# EAGLE design Audio-3 (EAGLE 7.2.0)
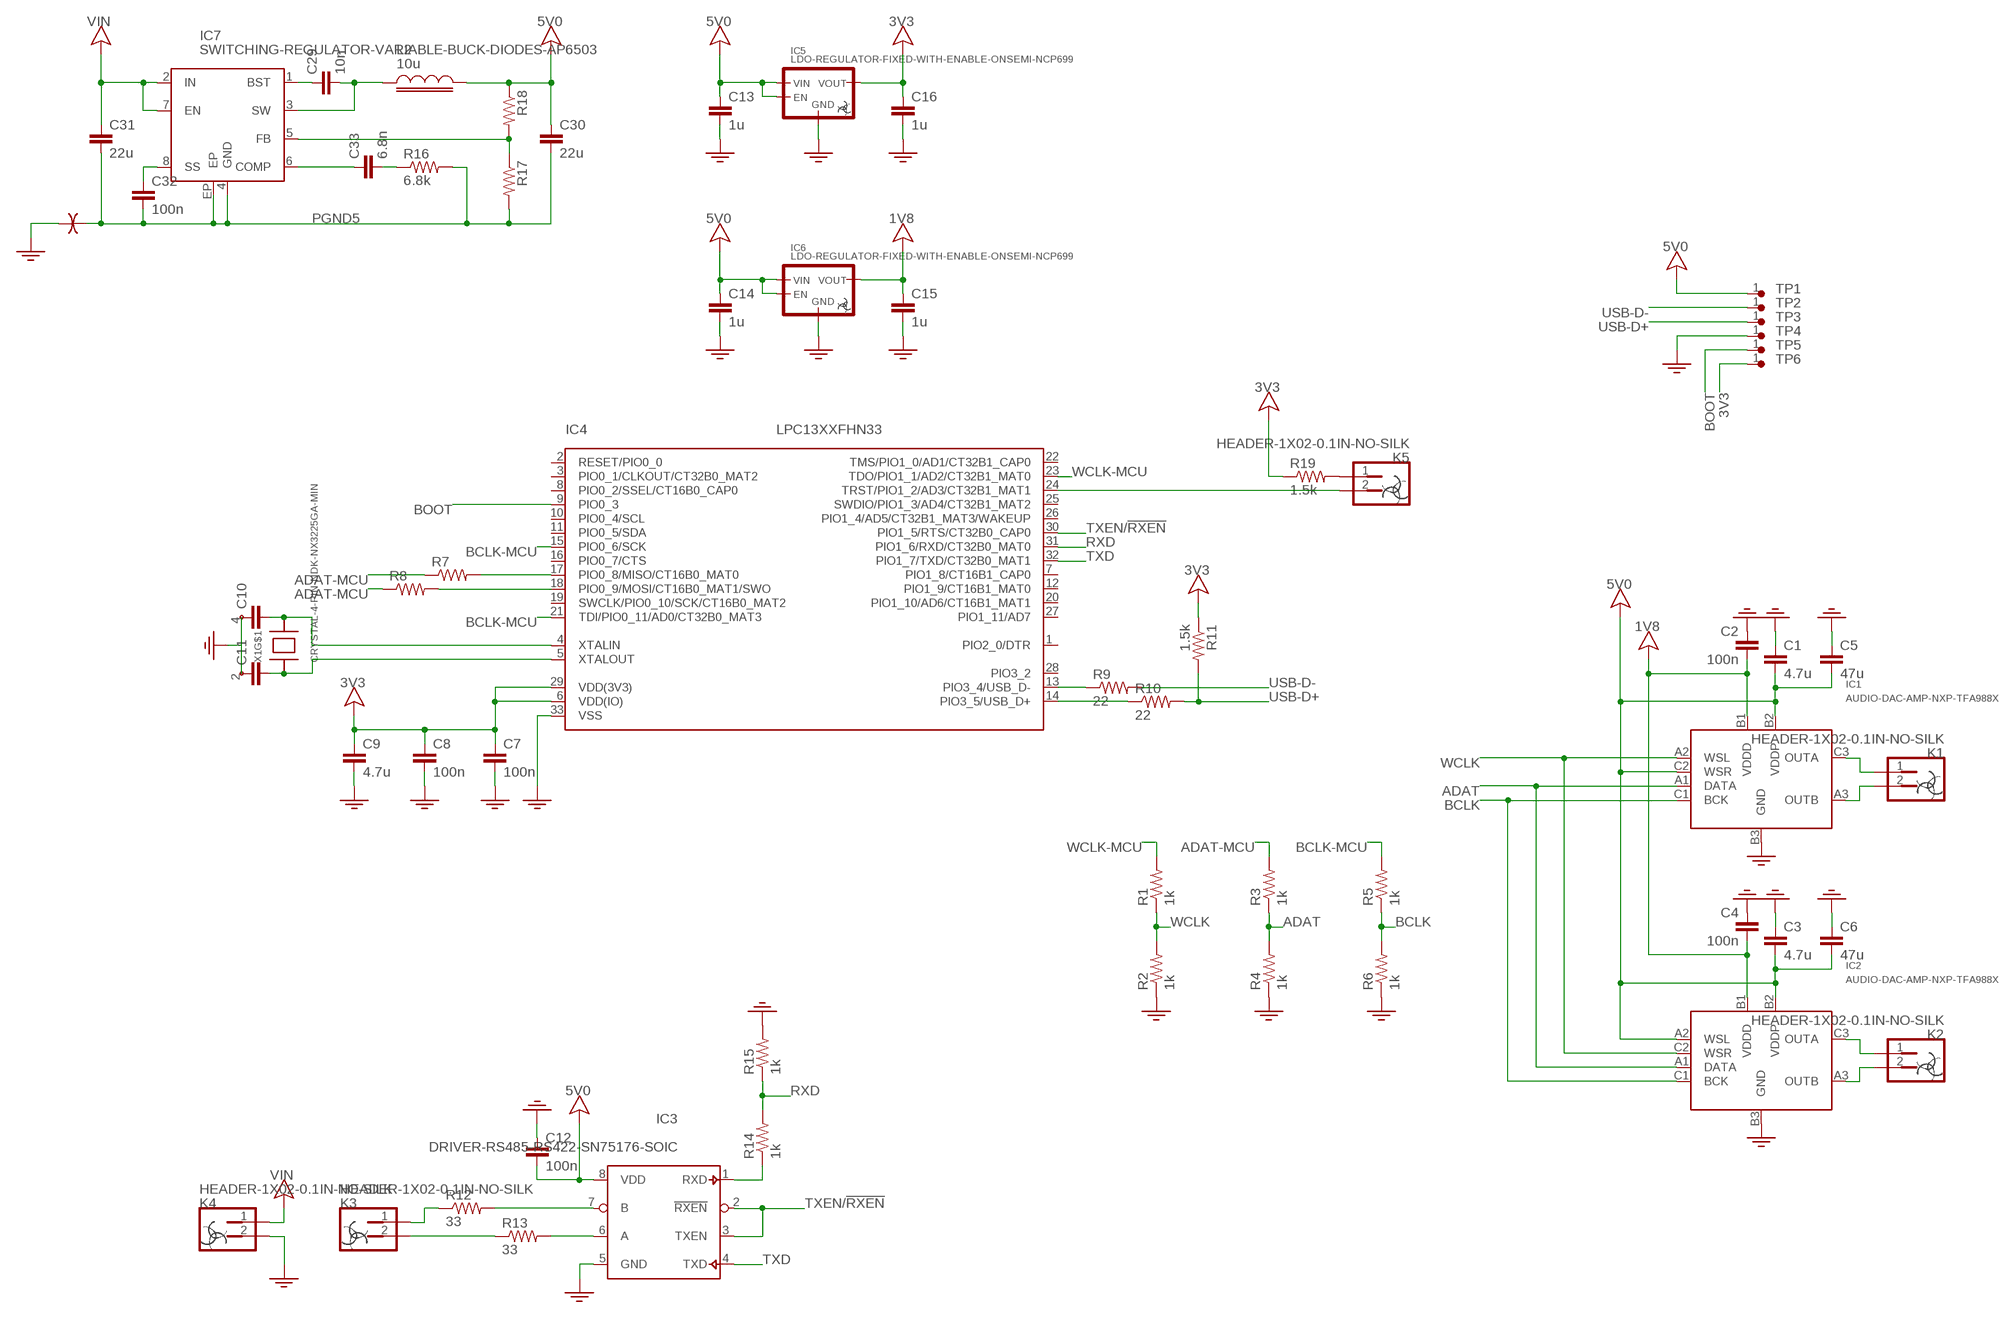
[diagram p0: schematic, sheet 1]

## Parts
C1  4.7u  CAP-0603-MIN  [0603-MIN]
C2  100n  CAP-0603-MIN  [0603-MIN]
C3  4.7u  CAP-0603-MIN  [0603-MIN]
C4  100n  CAP-0603-MIN  [0603-MIN]
C5  47u  CAP-1206-MIN  [1206-MIN]
C6  47u  CAP-1206-MIN  [1206-MIN]
C7  100n  CAP-0603-MIN  [0603-MIN]
C8  100n  CAP-0603-MIN  [0603-MIN]
C9  4.7u  CAP-0603-MIN  [0603-MIN]
C10  CAP-0603-MIN  [0603-MIN]
C11  CAP-0603-MIN  [0603-MIN]
C12  100n  CAP-0603-MIN  [0603-MIN]
C13  1u  CAP-0603-MIN  [0603-MIN]
C14  1u  CAP-0603-MIN  [0603-MIN]
C15  1u  CAP-0603-MIN  [0603-MIN]
C16  1u  CAP-0603-MIN  [0603-MIN]
C29  10n  CAP-0603-MIN  [0603-MIN]
C30  22u  CAP-1206  [1206]
C31  22u  CAP-1206  [1206]
C32  100n  CAP-0603-MIN  [0603-MIN]
C33  6.8n  CAP-0603-MIN  [0603-MIN]
IC1  AUDIO-DAC-AMP-NXP-TFA988X  [NXP-TFA988X-WLCSP9]
IC2  AUDIO-DAC-AMP-NXP-TFA988X  [NXP-TFA988X-WLCSP9]
IC3  DRIVER-RS485-RS422-SN75176-SOIC  [EIAJ-SOIC8]
IC4  LPC13XXFHN33  [HVQFN33-7X7MM]
IC5  LDO-REGULATOR-FIXED-WITH-ENABLE-ONSEMI-NCP699  [SOT23-5]
IC6  LDO-REGULATOR-FIXED-WITH-ENABLE-ONSEMI-NCP699  [SOT23-5]
IC7  SWITCHING-REGULATOR-VARIABLE-BUCK-DIODES-AP6503  [EIAJ-SOIC8-3.9MM-EXPOSED-PAD]
K1  HEADER-1X02-0.1IN-NO-SILK  [HEADER-1X02-NO-SILK]
K2  HEADER-1X02-0.1IN-NO-SILK  [HEADER-1X02-NO-SILK]
K3  HEADER-1X02-0.1IN-NO-SILK  [HEADER-1X02-NO-SILK]
K4  HEADER-1X02-0.1IN-NO-SILK  [HEADER-1X02-NO-SILK]
K5  HEADER-1X02-0.1IN-NO-SILK  [HEADER-1X02-NO-SILK]
L2  10u  INDUCTOR-1210  [1210]
R1  1k  RESISTOR-0603-MIN  [0603-MIN]
R2  1k  RESISTOR-0603-MIN  [0603-MIN]
R3  1k  RESISTOR-0603-MIN  [0603-MIN]
R4  1k  RESISTOR-0603-MIN  [0603-MIN]
R5  1k  RESISTOR-0603-MIN  [0603-MIN]
R6  1k  RESISTOR-0603-MIN  [0603-MIN]
R7  RESISTOR-0603-MIN  [0603-MIN]
R8  RESISTOR-0603-MIN  [0603-MIN]
R9  22  RESISTOR-0603-MIN  [0603-MIN]
R10  22  RESISTOR-0603-MIN  [0603-MIN]
R11  1.5k  RESISTOR-0603-MIN  [0603-MIN]
R12  33  RESISTOR-0805  [0805-MIN]
R13  33  RESISTOR-0805  [0805-MIN]
R14  1k  RESISTOR-0603-MIN  [0603-MIN]
R15  1k  RESISTOR-0603-MIN  [0603-MIN]
R16  6.8k  RESISTOR-0603-MIN  [0603-MIN]
R17  RESISTOR-0603-MIN  [0603-MIN]
R18  RESISTOR-0603-MIN  [0603-MIN]
R19  1.5k  RESISTOR-0603-MIN  [0603-MIN]
TP1  TEST-POINT-0.75MM  [TEST-POINT-0.75MM]
TP2  TEST-POINT-0.75MM  [TEST-POINT-0.75MM]
TP3  TEST-POINT-0.75MM  [TEST-POINT-0.75MM]
TP4  TEST-POINT-0.75MM  [TEST-POINT-0.75MM]
TP5  TEST-POINT-0.75MM  [TEST-POINT-0.75MM]
TP6  TEST-POINT-0.75MM  [TEST-POINT-0.75MM]
U4  GND-ISOLATOR-0.032"  [GND-ISOLATOR-0.032"]
X1  CRYSTAL-4-PIN-NDK-NX3225GA-MIN  [CRYSTAL-NDK-NX3225GA-3X2.5MM-MIN]

## Nets
1V8: C2.1 C4.1 C15.2 IC1.B1(VDDD) IC2.B1(VDDD) IC6.5(VOUT) ; supply symbol labelled V
3V3: C7.2 C8.2 C9.2 C16.2 IC4.6(VDD(IO)) IC4.29(VDD(3V3)) IC5.5(VOUT) R11.1 R19.1 TP6.1 ; supply symbol labelled V
5V0: C1.1 C3.1 C5.1 C6.1 C12.1 C13.2 C14.2 C30.2 IC1.B2(VDDP) IC1.C2(WSR) IC2.A2(WSL) IC2.B2(VDDP) IC3.8(VDD) IC5.1(VIN) IC5.3(EN) IC6.1(VIN) IC6.3(EN) L2.2 R18.1 TP1.1 ; supply symbol labelled V
5V0FB: IC7.5(FB) R17.1 R18.2
ADAT: IC1.A1(DATA) IC2.A1(DATA) R3.1 R4.2
ADAT-MCU: R3.2 R7.1 R8.1
BCLK: IC1.C1(BCK) IC2.C1(BCK) R5.1 R6.2
BCLK-MCU: IC4.15(PIO0_6/SCK) IC4.21(TDI/PIO0_11/AD0/CT32B0_MAT3) R5.2
BOOT: IC4.9(PIO0_3) TP5.1
GND: C1.2 C2.2 C3.2 C4.2 C5.2 C6.2 C7.1 C8.1 C9.1 C10.2 C11.2 C12.2 C13.1 C14.1 C15.1 C16.1 IC1.B3(GND) IC2.B3(GND) IC3.5(GND) IC4.33(VSS) IC5.2(GND) IC6.2(GND) K4.2 R2.1 R4.1 R6.1 R15.2 TP4.1 U4.B X1.2 X1.4
N$1: IC4.17(PIO0_8/MISO/CT16B0_MAT0) R7.2
N$2: IC4.18(PIO0_9/MOSI/CT16B0_MAT1/SWO) R8.2
N$3: C10.1 IC4.4(XTALIN) X1.3
N$4: C11.1 IC4.5(XTALOUT) X1.1
N$5: IC4.13(PIO3_4/USB_D-) R9.1
N$6: IC4.14(PIO3_5/USB_D+) R10.1
N$7: IC3.7(B) R12.2
N$8: IC1.C3(OUTA) K1.1
N$9: IC1.A3(OUTB) K1.2
N$10: IC2.C3(OUTA) K2.1
N$11: IC2.A3(OUTB) K2.2
N$12: IC3.6(A) R13.2
N$13: C29.1 IC7.3(SW) L2.1
N$14: IC3.1(RXD) R14.1
N$15: C29.2 IC7.1(BST)
N$16: C33.2 IC7.6(COMP)
N$17: C33.1 R16.1
N$18: K3.2 R13.1
N$19: K3.1 R12.1
N$20: C32.2 IC7.8(SS)
N$22: K5.1 R19.2
N$23: IC4.24(TRST/PIO1_2/AD3/CT32B1_MAT1) K5.2
PGND5: C30.1 C31.1 C32.1 IC7.4(GND) IC7.EP R16.2 R17.2 U4.A
RXD: IC4.31(PIO1_6/RXD/CT32B0_MAT0) R14.2 R15.1
TXD: IC3.4(TXD) IC4.32(PIO1_7/TXD/CT32B0_MAT1)
TXEN/!RXEN: IC3.2(!RXEN) IC3.3(TXEN) IC4.30(PIO1_5/RTS/CT32B0_CAP0)
USB-D+: R10.2 R11.2 TP3.1
USB-D-: R9.2 TP2.1
VIN: C31.2 IC7.2(IN) IC7.7(EN) K4.1 ; supply symbol labelled V
WCLK: IC1.A2(WSL) IC2.C2(WSR) R1.1 R2.2
WCLK-MCU: IC4.23(TDO/PIO1_1/AD2/CT32B1_MAT0) R1.2
Unconnected: IC4.1(PIO2_0/DTR) IC4.2(RESET/PIO0_0) IC4.3(PIO0_1/CLKOUT/CT32B0_MAT2) IC4.7(PIO1_8/CT16B1_CAP0) IC4.8(PIO0_2/SSEL/CT16B0_CAP0) IC4.10(PIO0_4/SCL) IC4.11(PIO0_5/SDA) IC4.12(PIO1_9/CT16B1_MAT0) IC4.16(PIO0_7/CTS) IC4.19(SWCLK/PIO0_10/SCK/CT16B0_MAT2) IC4.20(PIO1_10/AD6/CT16B1_MAT1) IC4.22(TMS/PIO1_0/AD1/CT32B1_CAP0) IC4.25(SWDIO/PIO1_3/AD4/CT32B1_MAT2) IC4.26(PIO1_4/AD5/CT32B1_MAT3/WAKEUP) IC4.27(PIO1_11/AD7) IC4.28(PIO3_2)

## Library data of the parts
C1-C16 C29-C33 = Outbreak:CAP
IC1 IC2 = Outbreak:AUDIO-DAC-AMP-NXP-TFA988X
IC3 = Outbreak:DRIVER-RS485-RS422-SN75176
IC4 = Outbreak:LPC13XXFHN33: LPC1313 72 MHz 32-bit ARM Cortex-M3 based microcontroller featuring a high level of integration and low power consumption. 32 kB Flash, 8 kB SRAM MarcVl - Datasheet available on www.nxp.com
IC5 IC6 = Outbreak:LDO-REGULATOR-FIXED-WITH-ENABLE: Low Drop-Out (LDO) Volt Regulator with enable pin (active at logic high.)
IC7 = Outbreak:SWITCHING-REGULATOR-VARIABLE-BUCK-DIODES-AP6503
K1-K5 = Outbreak:HEADER-1X02
L2 = Outbreak:INDUCTOR
R1-R19 = Outbreak:RESISTOR: Resistor Basic schematic elements and footprints for 0603, 1206, and PTH resistors.
TP1-TP6 = Outbreak:TEST-POINT
U4 = Outbreak:GND-ISOLATOR
X1 = Outbreak:CRYSTAL-4-PIN

## Board
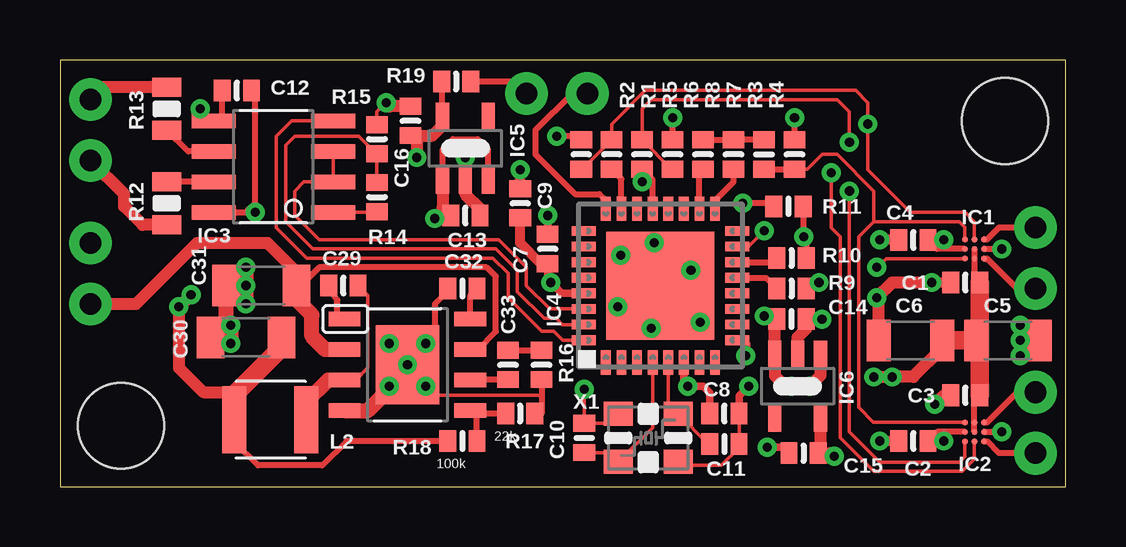
[diagram p1: board, top side]
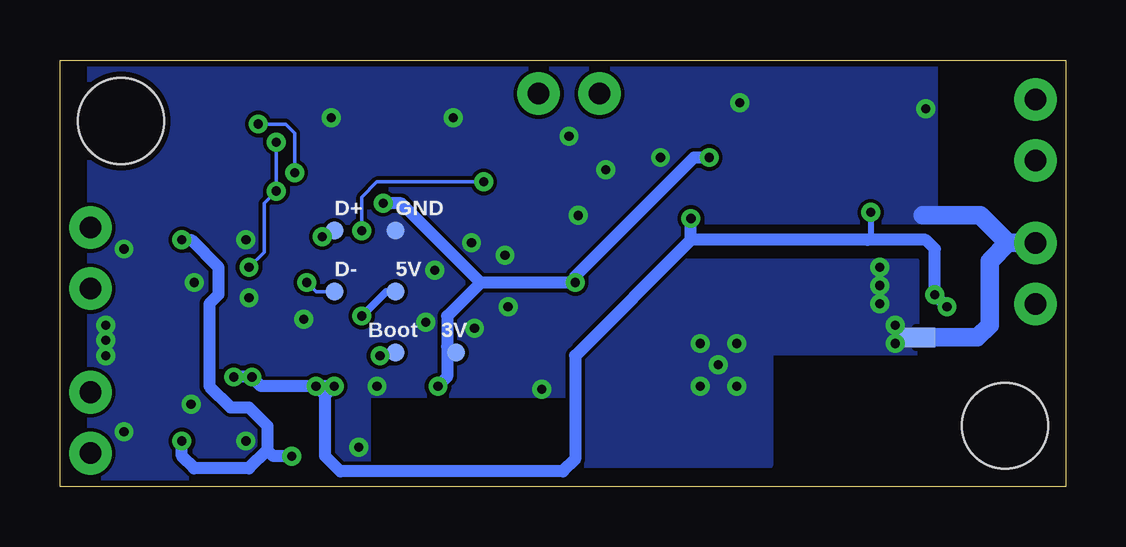
[diagram p2: board, bottom side, seen from below]

Size 41.91 x 17.78 mm. Coordinates in mm from the lower left corner, seen from the top.
Outline: 0,0 41.91,0 41.91,17.78 0,17.78 0,0
Copper layers (1*16): Top 0.035mm / dielectric 1.5mm / Bottom 0.035mm
Design rules "default *": minimum track width 6mil, minimum drill 15mil, track to track 6mil, track to pad 6mil, pad to pad 6mil, via to via 6mil, smd to smd 6mil, copper to edge 10mil, drill to drill 8mil, minimum pad ring 10mil, minimum via ring 8mil, stop-mask expansion 4mil, vias tented up to drill 20mil, thermal gap 10mil
Holes 3.58 mm at 2.54,2.54 39.37,15.24

### Footprints (pad centres in the part's own frame; a part is rotated, then mirrored left to right if it is on the bottom)
0603-MIN = smd 0.7 x 0.9: 1 -0.61,0; 2 0.61,0
1206-MIN = smd 1 x 1.727: 1 -1.323,0; 2 1.323,0
1206 = smd 1.143 x 1.727: 1 -1.473,0; 2 1.473,0
NXP-TFA988X-WLCSP9 = smd 0.26 x 0.26: A1 -0.4,0.4; A2 0,0.4; A3 0.4,0.4; B1 -0.4,0; B2 0,0; B3 0.4,0; C1 -0.4,-0.4; C2 0,-0.4; C3 0.4,-0.4
EIAJ-SOIC8 = smd 1.829 x 0.61: 1 -2.491,1.905; 2 -2.491,0.635; 3 -2.491,-0.635; 4 -2.491,-1.905; 5 2.491,-1.905; 6 2.491,-0.635; 7 2.491,0.635; 8 2.491,1.905
HVQFN33-7X7MM = smd 1.013 x 0.406: 1 -3.2,2.275; 2 -3.2,1.625; 3 -3.2,0.975; 4 -3.2,0.325; 5 -3.2,-0.325; 6 -3.2,-0.975; 7 -3.2,-1.625; 8 -3.2,-2.275; 17 3.2,-2.275; 18 3.2,-1.625; 19 3.2,-0.975; 20 3.2,-0.325; 21 3.2,0.325; 22 3.2,0.975; 23 3.2,1.625; 24 3.2,2.275 | smd 0.406 x 1.013: 9 -2.275,-3.2; 10 -1.625,-3.2; 11 -0.975,-3.2; 12 -0.325,-3.2; 13 0.325,-3.2; 14 0.975,-3.2; 15 1.625,-3.2; 16 2.275,-3.2; 25 2.275,3.2; 26 1.625,3.2; 27 0.975,3.2; 28 0.325,3.2; 29 -0.325,3.2; 30 -0.975,3.2; 31 -1.625,3.2; 32 -2.275,3.2 | smd 4.5 x 4.5: 33 0,0
SOT23-5 = smd 0.55 x 1.2: 1 0.95,1.3; 2 0,1.3; 3 -0.95,1.3; 4 -0.95,-1.3; 5 0.95,-1.3
EIAJ-SOIC8-3.9MM-EXPOSED-PAD = smd 1.321 x 0.61: 1 -2.618,1.905; 2 -2.618,0.635; 3 -2.618,-0.635; 4 -2.618,-1.905; 5 2.618,-1.905; 6 2.618,-0.635; 7 2.618,0.635; 8 2.618,1.905 | smd 2.66 x 3.3: EP 0,0
HEADER-1X02-NO-SILK = drill 0.9 pad 1.778: 1 -1.27,0; 2 1.27,0
1210 = smd 1 x 2.8: 1 -1.5,0; 2 1.5,0
0805-MIN = smd 0.8 x 1.2: 1 -0.9,0; 2 0.9,0
TEST-POINT-0.75MM = smd 0.75 x 0.75: 1 0,0
GND-ISOLATOR-0.032" = smd 0.813 x 0.813: A -0.381,0; B 0.381,0
CRYSTAL-NDK-NX3225GA-3X2.5MM-MIN = smd 1.2 x 1: 1 -1.25,-1; 2 1.25,-1; 3 1.25,1; 4 -1.25,1

### Placement (x,y rotation side)
C1  37.72,8.51 180 top
C2  35.56,1.91 180 top
C3  37.72,3.81 180 top
C4  35.56,10.29 180 top
C5  39.5,6.1 0 top
C6  35.43,6.1 180 top
C7  20.32,9.91 270 top
C8  27.69,3.05 180 top
C9  19.18,11.81 270 top
C10  21.84,2.03 90 top
C11  27.69,1.78 0 top
C12  7.37,16.51 180 top
C13  16.89,11.3 180 top
C14  30.48,6.99 180 top
C15  30.99,1.4 0 top
C16  14.61,15.24 270 top
C29  11.81,8.38 180 top
C30  7.75,6.22 0 top
C31  8.38,8.38 0 top
C32  16.76,8.26 0 top
C33  18.67,5.08 270 top
IC1  38.1,9.91 0 top
IC2  38.1,2.29 0 top
IC3  8.89,13.34 180 top
IC4  25.02,8.38 90 top
IC5  16.89,14.1 180 top
IC6  30.73,4.19 0 top
IC7  14.48,5.08 0 top
K1  40.64,9.53 90 top
K2  40.64,2.67 90 top
K3  1.27,14.86 90 top
K4  1.27,8.89 90 top
K5  20.7,16.38 0 top
L2  8.76,2.79 180 top
R1  22.99,13.84 270 top
R2  21.72,13.84 270 top
R3  29.34,13.84 90 top
R4  30.61,13.84 270 top
R5  24.26,13.84 270 top
R6  25.53,13.84 270 top
R7  28.07,13.84 270 top
R8  26.8,13.84 270 top
R9  30.48,8.26 0 top
R10  30.48,9.53 0 top
R11  30.35,11.68 0 top
R12  4.45,11.81 90 top
R13  4.45,15.75 270 top
R14  13.21,12.06 90 top
R15  13.21,14.48 90 top
R16  20.07,5.08 270 top
R17  22k  [0603-MIN]  19.18,3.05 0 top
R18  100k  [0603-MIN]  16.76,1.91 0 top
R19  16.51,16.89 0 top
TP1  27.94,8.13 0 bottom
TP2  30.48,8.13 0 bottom
TP3  30.48,10.67 0 bottom
TP4  27.94,10.67 0 bottom
TP5  27.94,5.59 0 bottom
TP6  25.4,5.59 0 bottom
U4  6.22,6.22 0 bottom
X1  24.51,2.03 180 top

### Tracks (layer width: path | path; a pad name or v marks a point on that pad's centre or on a via)
1V8  (via drill 0.38)
  Top 0.254: IC2.B1 36.55,2.29 C2.1 v36.83,1.91 | IC1.B1 36.55,9.91 C4.1 v36.83,10.29
  Top 0.508: v32.26,1.27 32.13,1.4 C15.2 31.68,1.48 IC6.5
  Bottom 0.508: v36.83,10.29 36.45,10.29 35.31,9.14 35.31,8 35.69,7.62 35.69,4.19 34.8,3.3 34.04,3.3 33.27,2.54 33.27,1.52 | 33.27,1.52 34.04,0.76 36.32,0.76 36.83,1.27 v36.83,1.91 | v32.26,1.27 33.02,1.27 33.27,1.52
3V3  (via drill 0.38)
  Top 0.254: R11.1 29.74,11.81 v28.45,11.81 | R19.1 15.9,15.44 IC5.5
  Top 0.305: IC4.29 20.9,8.06 v20.45,8.51 20.32,8.64 C7.2 | IC4.6 25.99,4.36 v26.16,4.19 26.8,4.19 27.08,3.91 C8.2
  Top 0.406: C7.2 20.04,9.3 19.18,10.16 C9.2
  Top 0.508: v14.86,13.72 14.86,14.38 C16.2 15.52,14.63 15.94,15.05 IC5.5
  Bottom 0.152: TP6.1 25.78,5.59 25.78,5.84
  Bottom 0.508: v14.86,13.72 15.49,13.72 20.45,8.76 v20.45,8.51 24.38,8.51 | 24.38,8.51 25.78,7.11 25.78,5.84 25.78,4.57 v26.16,4.19 | 24.38,8.51 27.69,11.81 v28.45,11.81
5V0  (via drill 0.38)
  Top 0.152: 7.26,1.88 L2.2 7.26,3.33
  Top 0.254: IC2.B2 IC2.A2 38.1,3.83 C3.1 | IC1.B2 IC1.C2 38.1,8.48 C1.1 | R18.1 11.94,1.91 10.92,0.89 8.26,0.89 7.26,1.88 | IC3.8 7.75,11.43 | 7.75,11.43 8.13,11.81 8.13,16.36 C12.1 | 7.75,11.43 v8.13,11.43 | IC5.1 15.94,14.04 16.38,14.48 17.4,14.48 17.84,14.04 IC5.3
  Top 0.305: C14.2 29.46,6.99 v29.34,7.11
  Top 0.406: 38.17,8.35 C1.1 | 38.17,3.96 C3.1
  Top 0.508: IC6.1 31.68,4.63 v31.24,4.19 30.23,4.19 29.78,4.63 IC6.3 29.78,6.9 C14.2 | 7.26,3.83 7.26,3.94 5.97,3.94 4.95,4.95 v4.95,7.49 v5.46,8 | v15.62,11.18 15.75,11.3 C13.2 15.94,11.64 IC5.1 | C6.1 36.76,5.77 35.56,4.57 v34.67,4.57 v33.91,4.57
  Top 0.762: 7.26,3.33 7.26,3.83 9.22,5.79 C30.2 | C6.1 C5.1 38.33,6.1 | 38.33,6.1 C3.1 | 38.33,6.1 C1.1
  Bottom 0.254: v8.13,11.43 8.13,10.29 8.26,10.29
  Bottom 0.305: TP1.1 28.32,8.13 v29.34,7.11
  Bottom 0.508: 15.62,10.29 8.26,10.29 5.84,10.29 5.46,9.91 v5.46,8 v4.95,7.49 | 15.62,10.29 v15.62,11.18 | 15.62,10.29 20.45,5.46 20.45,1.14 20.95,0.64 30.23,0.64 30.86,1.27 30.86,3.81 | 30.86,3.81 v31.24,4.19 | 30.86,3.81 v30.48,4.19 v31.24,4.19 | v31.24,4.19 33.53,4.19 v33.91,4.57 v34.67,4.57
5V0FB
  Top 0.152: IC7.5 17.37,2.9 17.52,3.05
  Top 0.254: R18.2 17.37,2.9 | R17.1 17.52,3.05
ADAT
  Top 0.152: IC1.A1 37.7,10.81 37.47,11.05 33.91,11.05 | IC2.A1 33.89,2.69 33.27,3.3 33.27,10.41 33.91,11.05 | 33.91,11.05 33.91,12.32 32.38,13.84 31.75,13.84 31.14,13.23 R4.2
  Top 0.254: R3.1 R4.2
ADAT-MCU
  Top 0.254: R8.1 R7.1 R3.2
BCLK  (via drill 0.38)
  Top 0.152: IC2.C1 37.7,1.25 37.47,1.02 34.16,1.02 32.89,2.29 v32.89,12.32 | R6.2 25.48,13.23 R5.1 24.26,15.75 24.64,16.13 32.38,16.13 32.89,15.62 v32.89,14.35 | IC1.C1 34.44,9.51 v34.04,9.14
  Bottom 0.152: v34.04,9.14 33.4,9.78 33.4,11.81 v32.89,12.32 v32.89,14.35
BCLK-MCU  (via drill 0.38)
  Top 0.152: IC4.15 28.68,10.01 v29.34,10.67 | R5.2 v24.26,12.7
  Top 0.254: IC4.21 24.69,12.8 R5.2
  Bottom 0.152: v24.26,12.7 28.7,12.7 29.34,12.06 v29.34,10.67
BOOT  (via drill 0.38)
  Top 0.152: IC4.9 28.56,6.11 28.7,5.97 28.7,5.59 v28.57,5.46
  Bottom 0.152: TP5.1 28.45,5.59 v28.57,5.46
GND  (via drill 0.38)
  Top 0.152: X1.2 23,2.64 C10.2 v21.84,4.06 | X1.4 25.9,0.89 27.56,0.89 28.3,1.63 C11.2 C8.1 | R15.2 13.21,15.62 v13.59,16
  Top 0.254: IC1.B3 v39.24,9.91 | IC2.B3 v39.24,2.29 | R6.1 v25.53,15.37 | R2.1 21.72,14.61 v20.7,14.61 | R4.1 v30.61,15.37 | C12.2 6.76,15.24 IC3.5 5.84,15.29 v5.84,15.75
  Top 0.305: C8.1 28.3,3.79 v28.7,4.19 | C7.1 v20.32,11.3 | C15.1 30.35,1.4 30.1,1.65 v29.46,1.65
  Top 0.406: C2.2 v34.16,1.91 | C4.2 v34.16,10.29 | C1.2 v36.32,8.51 | C5.2 40.64,6.1 | 40.64,6.1 v40.01,6.73 v40.01,6.1 v40.01,5.46 40.64,6.1 | C9.1 v19.18,13.21
  Top 0.508: IC6.2 30.73,6.22 31.09,6.58 C14.1 v31.75,6.99 | v16.89,13.72 IC5.2 16.89,12.19 17.5,11.58 C13.1 | v24.77,10.16 25.02,10.03 IC4.33 25.02,6.99 v24.64,6.6 | C16.1 13.74,15.85 v13.59,16 | C3.2 36.83,3.81 v36.45,3.43 | C6.2 34.11,7.8 v34.04,7.87 34.67,8.51 v36.32,8.51
  Bottom 0.762: K4.2 2.41,10.16 | 2.41,10.16 3.17,9.4 3.17,6.73 3.68,6.22 U4.B | 2.41,10.16 3.56,11.3 5.97,11.3
  other vias: 23.24,7.49 23.37,9.65 26.29,9.02 26.67,6.86
  pour Bottom: 5.46,17.78 5.46,11.05 15.62,11.05 20.7,5.97 20.7,3.81 29.08,3.81 29.08,0 40.64,0 40.64,17.78
N$1
  Top 0.254: IC4.17 27.29,11.93 28.07,12.7 R7.2
N$2
  Top 0.254: IC4.18 26.64,13.08 R8.2
N$3
  Top 0.152: IC4.4 24.69,2.46 X1.3 22.74,1.42 C10.1
N$4
  Top 0.152: IC4.5 25.34,3.32 X1.1 27.02,1.78 C11.1
N$5
  Top 0.254: IC4.13 29.42,8.71 R9.1
N$6
  Top 0.254: IC4.14 30.08,9.36 R10.1
N$7
  Top 0.254: IC3.7 R12.2
N$8
  Top 0.254: IC1.C3 38.63,9.51 39.88,8.26 K1.1
N$9
  Top 0.254: IC1.A3 38.63,10.31 39.12,10.79 K1.2
N$10
  Top 0.254: IC2.C3 38.63,1.89 39.12,1.4 K2.1
N$11
  Top 0.254: IC2.A3 38.63,2.69 39.88,3.94 K2.2
N$12
  Top 0.254: IC3.6 5.34,13.97 R13.2
N$13
  Top 0.152: 12.32,4.45 12.83,4.95 12.83,7.98 C29.1
  Top 0.203: IC7.3 12.32,4.45
  Top 0.635: IC7.3 11.18,4.45 10.26,3.53 L2.1
N$14
  Top 0.152: IC3.1 13.18,11.43 R14.1
N$15
  Top 0.254: IC7.1 11.56,6.99 11.56,7.77 C29.2
N$16
  Top 0.152: IC7.6 17.1,4.47
  Top 0.254: 17.1,4.47 C33.2
N$17
  Top 0.254: C33.1 R16.1
N$18
  Top 0.508: R13.1 1.77,16.65 K3.2
N$19
  Top 0.508: R12.1 3.44,10.91 2.67,11.68 2.67,12.19 K3.1
N$20
  Top 0.254: IC7.8 17.1,7.98 C32.2
N$22
  Top 0.254: R19.2 18.92,16.89 K5.1
N$23
  Top 0.254: K5.2 21.34,16.38 19.81,14.86 19.81,13.84 21.46,12.19 22.48,12.19 22.74,11.93 IC4.24
PGND5  (via drill 0.38)
  Top 0.152: R16.2 20.07,3.81 14.48,3.81 14.48,4.83 | C32.1 16.15,8.15 | 15.62,6.22 IC7.EP
  Top 0.254: R16.2 20.07,3.05 R17.2 | 16.15,8.15 15.62,7.62 15.62,6.22
  Top 0.635: IC7.4 12.83,3.17 14.48,4.83 IC7.EP | v7.75,7.62 v7.75,8.38 v7.75,9.14 6.99,8.38 C31.1 6.91,6.86 C30.1 6.73,6.22 v7.11,6.73 v7.11,5.97
  other vias: 14.48,5.08 13.72,5.97 15.24,5.97 13.72,4.19 15.24,4.19
  pour Bottom: 6.22,9.4 6.22,5.59 12.32,5.59 12.32,0.89 20.07,0.89 20.07,9.4
RXD
  Top 0.152: R14.2 R15.1 13.18,13.87 12.45,14.61 9.78,14.61 9.4,14.22 9.4,11.05 10.54,9.91 18.16,9.91 19.05,9.02 19.05,8.13 20.17,7.01 20.68,7.01 20.93,6.76 IC4.31
TXD
  Top 0.152: IC4.32 20.94,6.11 20.57,6.48 20.07,6.48 18.67,7.87 18.67,8.89 18.03,9.53 10.29,9.53 9.02,10.79 9.02,14.61 9.65,15.24 IC3.4
TXEN/!RXEN
  Top 0.152: IC4.30 20.41,7.41 19.43,8.38 19.43,9.14 18.29,10.29 10.79,10.29 9.78,11.3 9.78,12.32 10.16,12.7 IC3.2 IC3.3
USB-D+  (via drill 0.38)
  Top 0.152: 30.96,10.44 v30.99,10.41
  Top 0.254: R10.2 31.09,10.31 30.96,10.44 R11.2
  Bottom 0.152: TP3.1 30.73,10.67 v30.99,10.41
USB-D-  (via drill 0.38)
  Top 0.152: R9.2 31.37,8.26 v31.62,8.51
  Bottom 0.152: TP2.1 31.24,8.13 v31.62,8.51
VIN
  Top 0.152: IC7.7 17.4,5.71
  Top 0.254: 17.4,5.71 18.16,6.48 18.16,8.76 17.78,9.14 10.79,9.14 10.03,8.38 C31.2
  Top 0.508: K4.1 3.17,7.62 5.71,10.16 8.64,10.16 9.86,8.94 C31.2
  Top 0.635: IC7.2 11.05,5.71 10.49,6.27 10.49,7.16 9.86,7.8 C31.2
WCLK  (via drill 0.38)
  Top 0.152: IC1.A2 38.1,11.05 37.72,11.43 35.43,11.43 33.66,13.21 v33.66,15.11 33.66,16 33.15,16.51 24.38,16.51 22.99,15.11 R1.1 21.77,13.23 R2.2 | IC2.C2 38.1,1.14 37.59,0.64 33.91,0.64 32.51,2.03 32.51,10.41 32.13,10.79 v32.13,13.08
  Bottom 0.152: v32.13,13.08 32.13,14.73 32.51,15.11 v33.66,15.11
WCLK-MCU
  Top 0.254: IC4.23 23.39,12.83 R1.2

### Text on the board
bPlace: GND | D+ | 5V | D- | 3V | Boot